# EAGLE board Tempura_V2 (EAGLE 9.6.1), part 1 of 2
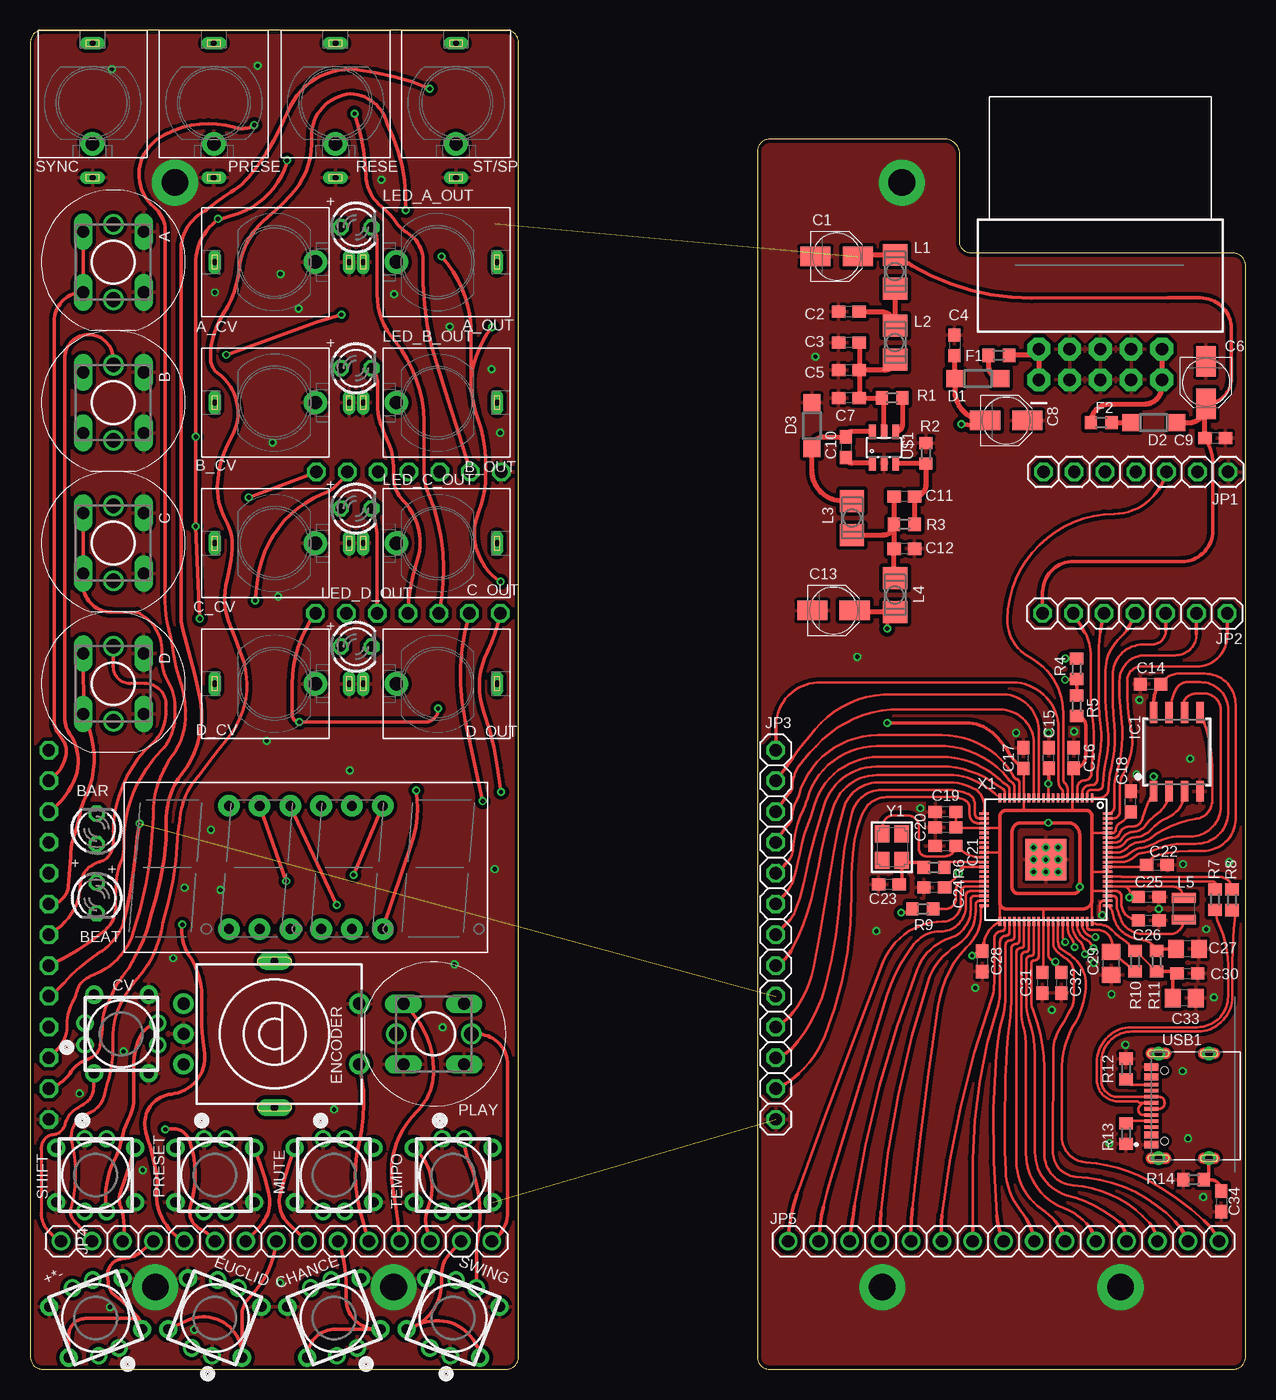
[diagram p3: board, top side]
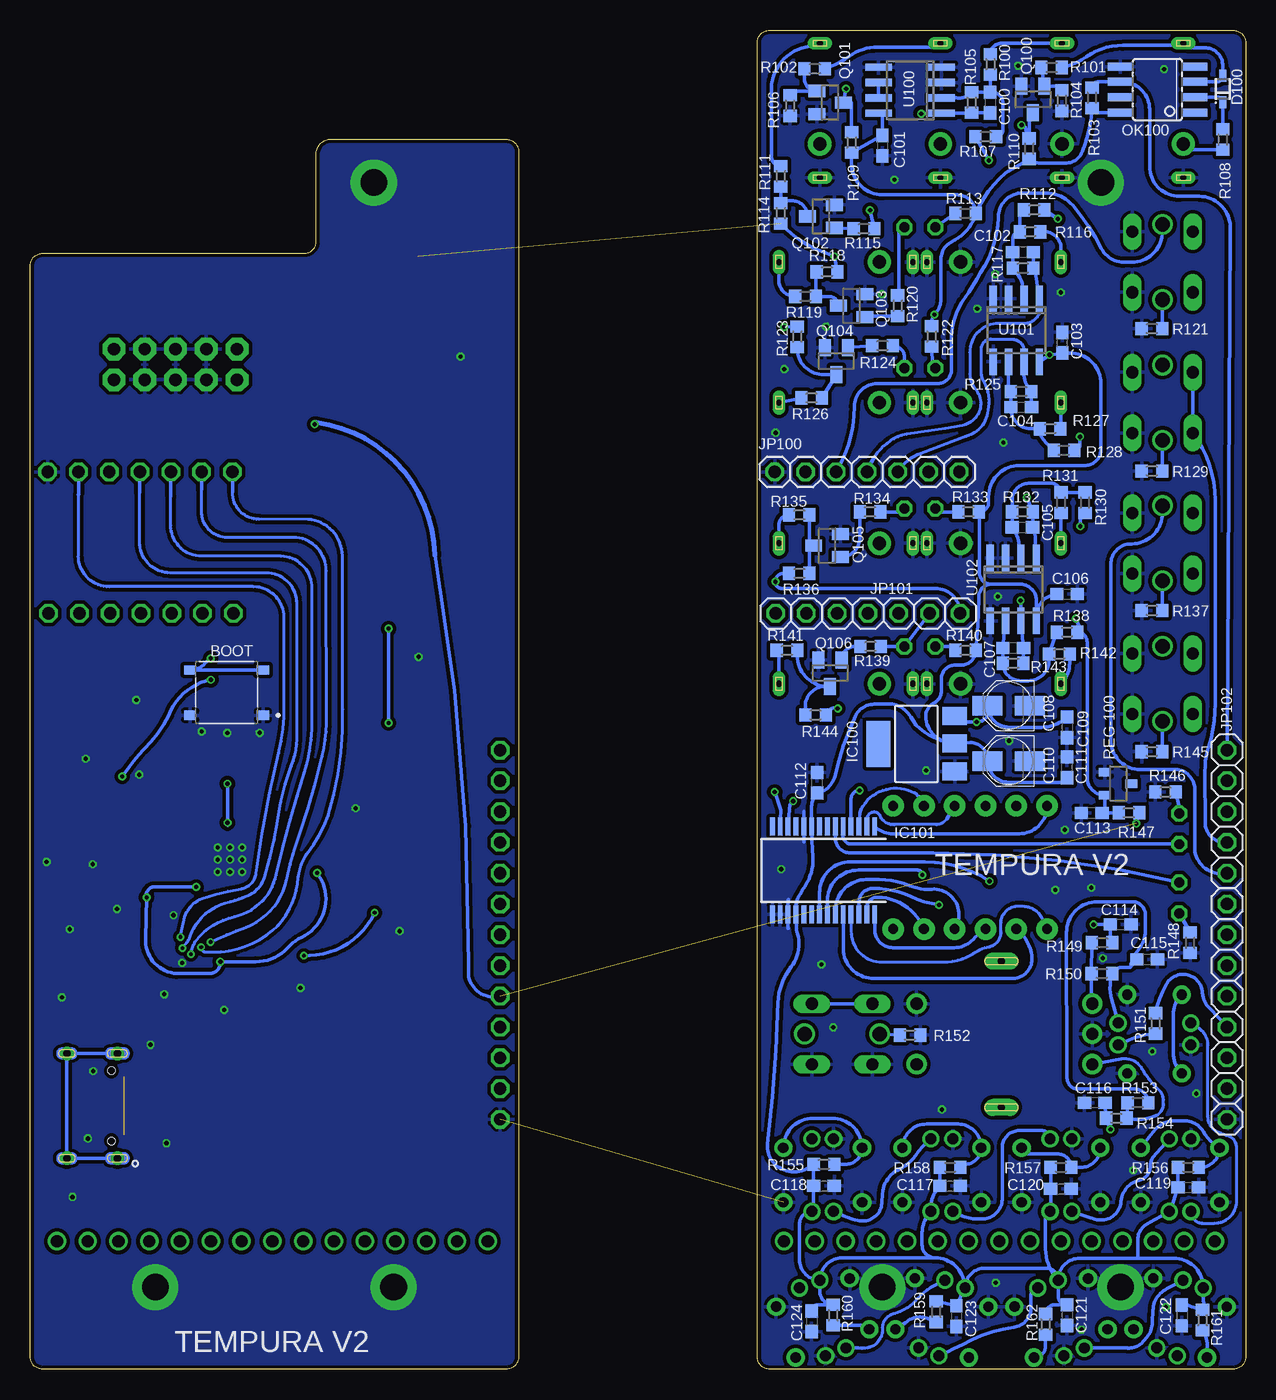
[diagram p4: board, bottom side, seen from below]

Size 100.3 x 110.5 mm. Coordinates in mm from the lower left corner, seen from the top.
Outline: 1,0 39.3,0 arc90 40.3,1 40.3,109.5 arc90 39.3,110.5 1,110.5 arc90 0,109.5 0,1 arc90 1,0
Outline: 61,0 99.3,0 arc90 100.3,1 100.3,36.21 100.3,91.09 arc90 99.3,92.09 77.7,92.09 arc-90 76.7,93.09 76.7,99.99 arc90 75.7,101.5 61,101.5 arc90 60,100.5 60,1 arc90 61,0
Copper layers (1*16): Top 0.035mm / dielectric 1.5mm / Bottom 0.035mm
Design rules "Covered_Vias": minimum track width 6mil, minimum drill 12mil, track to track 6mil, track to pad 6mil, pad to pad 6mil, via to via 6mil, smd to smd 0mil, copper to edge 10mil, drill to drill 10mil, minimum pad ring 10mil, minimum via ring 6mil, stop-mask expansion 2mil, vias tented up to drill 100mil, thermal gap 10mil

## Footprints (pad centres in the part's own frame; a part is rotated, then mirrored left to right if it is on the bottom)
BUTTON_PIXEL_ç = drill 0.85 pad 1.5: 1 -2.25,-3.25; 2 2.25,-3.25; 3 -2.25,3.25; 4 2.25,3.25 | drill 0.9 pad 1.422: DIN 3,-0.9; DOUT -3,0.9; GND -3,-0.9; VDD 3,0.9
TIMEBUTTON_HOLES_LEDS = drill 1 long: 1 -2.5,2.5; 2 2.5,2.5; 3 -2.5,-2.5; 4 2.5,-2.5 | drill 1.2: P$1 -3.1,0; P$2 3.1,0
NOHOLER_GND_SHORT_PADMINI_GND = drill 0.5 pad 1.016 long: P1 0,-6.15; P3 0,4.92 | drill 1.1 pad 1.93: P2 0,-3.38
LED3MM = drill 0.813 octagon: A -1.27,0; K 1.27,0
SW_TS-1187A-B-A-B = smd 1 x 0.75: A -3,1.875; B 3,1.875; C -3,-1.875; D 3,-1.875
PANASONIC_B = smd 2.5 x 1.6: + 1.75,0; - -1.75,0
C0603 = smd 1.1 x 1: 1 -0.85,0; 2 0.85,0
0603 = smd 1.1 x 1: 1 -0.85,0; 2 0.85,0
C0805 = smd 1.3 x 1.5: 1 -0.95,0; 2 0.95,0
SOD123 = smd 1.4 x 1.4: A 1.9,0; C -1.9,0
SOD323F = smd 1 x 0.6: A 1.1,0; C -1.1,0
CI-11 = drill 1 pad 1.676: A -2.5,-7.5; B 0,-7.5; C 2.5,-7.5; D -2.5,7; E 2.5,7 | drill 0.6 pad 1.422 long: C1 -6,0; C2 6.065,0
R0603 = smd 1 x 1.1: 1 -0.85,0; 2 0.85,0
SOIC-8 = smd 0.61 x 1.702: 1 -1.905,-3.251; 2 -0.635,-3.251; 3 0.635,-3.251; 4 1.905,-3.251; 5 1.905,3.251; 6 0.635,3.251; 7 -0.635,3.251; 8 -1.905,3.251
SOT223 = smd 1.499 x 2.007: 1 -2.261,-3.15; 2 0.025,-3.15; 3 2.311,-3.15 | smd 3.81 x 2.007: 4 0,3.15
SSOP28 = smd 0.4 x 1.5: 1 -4.225,-3.625; 2 -3.575,-3.625; 3 -2.925,-3.625; 4 -2.275,-3.625; 5 -1.625,-3.625; 6 -0.975,-3.625; 7 -0.325,-3.625; 8 0.325,-3.625; 9 0.975,-3.625; 10 1.625,-3.625; 11 2.275,-3.625; 12 2.925,-3.625; 13 3.575,-3.625; 14 4.225,-3.625; 15 4.225,3.625; 16 3.575,3.625; 17 2.925,3.625; 18 2.275,3.625; 19 1.625,3.625; 20 0.975,3.625; 21 0.325,3.625; 22 -0.325,3.625; 23 -0.975,3.625; 24 -1.625,3.625; 25 -2.275,3.625; 26 -2.925,3.625; 27 -3.575,3.625; 28 -4.225,3.625
1X07ç = drill 1.016 octagon: 1 -7.62,0; 2 -5.08,0; 3 -2.54,0; 4 0,0; 5 2.54,0; 6 5.08,0; 7 7.62,0
1X13ç = drill 1.016 octagon: 1 -13.97,0; 2 -11.43,0; 3 -8.89,0; 4 -6.35,0; 5 -3.81,0; 6 -1.27,0; 7 1.27,0; 8 3.81,0; 9 6.35,0; 10 8.89,0; 11 11.43,0; 12 13.97,0; 13 16.51,0
1X15ç = drill 1.016: 1 -17.78,0; 2 -15.24,0; 3 -12.7,0; 4 -10.16,0; 5 -7.62,0; 6 -5.08,0; 7 -2.54,0; 8 0,0; 9 2.54,0; 10 5.08,0; 11 7.62,0; 12 10.16,0; 13 12.7,0; 14 15.24,0; 15 17.78,0
L3225P = smd 1.8 x 2: 1 -1.4,0; 2 1.4,0
1008(2520) = smd 0.8 x 2: 1 -0.9,0; 2 0.9,0
7-SEGMENT-4DIGIT-30MM = drill 0.8 pad 1.778: 1 -6.35,-5.08; 2 -3.81,-5.08; 3 -1.27,-5.08; 4 1.27,-5.08; 5 3.81,-5.08; 6 6.35,-5.08; 7 6.35,5.08; 8 3.81,5.08; 9 1.27,5.08; 10 -1.27,5.08; 11 -3.81,5.08; 12 -6.35,5.08
SOIC08 = smd 0.66 x 2.032: 1 -1.905,-3.073; 2 -0.635,-3.073; 3 0.635,-3.073; 4 1.905,-3.073; 5 1.905,3.073; 6 0.635,3.073; 7 -0.635,3.073; 8 -1.905,3.073
2X5-POWER_ACODADO = drill 1.016 pad 1.88 octagon: 1 -1.27,5.08; 2 1.27,5.08; 3 -1.27,2.54; 4 1.27,2.54; 5 -1.27,0; 6 1.27,0; 7 -1.27,-2.54; 8 1.27,-2.54; 9 -1.27,-5.08; 10 1.27,-5.08
SOT23 = smd 1 x 1.4: 1 -0.95,-1.1; 2 0.95,-1.1; 3 0,1.1
DBZ_R-PDSO-G3 = smd 0.7 x 1: 1 -0.95,-1.1; 2 0.95,-1.1; 3 0,1.1
SO08 = smd 0.6 x 2.2: 1 -1.905,-2.6; 2 -0.635,-2.6; 3 0.635,-2.6; 4 1.905,-2.6; 5 1.905,2.6; 6 0.635,2.6; 7 -0.635,2.6; 8 -1.905,2.6
SOT23-6 = smd 0.55 x 1.2: 1 -0.95,-1.3; 2 0,-1.3; 3 0.95,-1.3; 4 0.95,1.3; 5 0,1.3; 6 -0.95,1.3
HRO_TYPE-C-31-M-12 = smd 0.6 x 1.14: A1_B12 -3.2,4.75; A4_B9 -2.4,4.75; B1_A12 3.2,4.75; B4_A9 2.4,4.75 | smd 0.3 x 1.14: A5 -1.25,4.75; A6 -0.25,4.75; A7 0.25,4.75; A8 1.25,4.75; B5 1.75,4.75; B6 0.75,4.75; B7 -0.75,4.75; B8 -1.75,4.75 | drill 0.6 pad 0.9: S1 -4.325,4.17; S2 4.325,4.17; S3 -4.325,0; S4 4.325,0 | hole 0.6: -2.89,3.68; 2.89,3.68
QFN80 = smd 0.78 x 0.22: 1 -5.09,3.8; 2 -5.09,3.4; 3 -5.09,3; 4 -5.09,2.6; 5 -5.09,2.2; 6 -5.09,1.8; 7 -5.09,1.4; 8 -5.09,1; 9 -5.09,0.6; 10 -5.09,0.2; 11 -5.09,-0.2; 12 -5.09,-0.6; 13 -5.09,-1; 14 -5.09,-1.4; 15 -5.09,-1.8; 16 -5.09,-2.2; 17 -5.09,-2.6; 18 -5.09,-3; 19 -5.09,-3.4; 20 -5.09,-3.8; 41 5.1,-3.8; 42 5.1,-3.4; 43 5.1,-3; 44 5.1,-2.6; 45 5.1,-2.2; 46 5.1,-1.8; 47 5.1,-1.4; 48 5.1,-1; 49 5.1,-0.6; 50 5.1,-0.2; 51 5.1,0.2; 52 5.1,0.6; 53 5.1,1; 54 5.1,1.4; 55 5.1,1.8; 56 5.1,2.2; 57 5.1,2.6; 58 5.1,3; 59 5.1,3.4; 60 5.1,3.8 | smd 0.22 x 0.78: 21 -3.8,-5.1; 22 -3.4,-5.1; 23 -3,-5.1; 24 -2.6,-5.1; 25 -2.2,-5.1; 26 -1.8,-5.1; 27 -1.4,-5.1; 28 -1,-5.1; 29 -0.6,-5.1; 30 -0.2,-5.1; 31 0.2,-5.1; 32 0.6,-5.1; 33 1,-5.1; 34 1.4,-5.1; 35 1.8,-5.1; 36 2.2,-5.1; 37 2.6,-5.1; 38 3,-5.1; 39 3.4,-5.1; 40 3.8,-5.1; 61 3.8,5.1; 62 3.4,5.1; 63 3,5.1; 64 2.6,5.1; 65 2.2,5.1; 66 1.8,5.1; 67 1.4,5.1; 68 1,5.1; 69 0.6,5.1; 70 0.2,5.1; 71 -0.2,5.1; 72 -0.6,5.1; 73 -1,5.1; 74 -1.4,5.1; 75 -1.8,5.1; 76 -2.2,5.1; 77 -2.6,5.1; 78 -3,5.1; 79 -3.4,5.1; 80 -3.8,5.1 | smd 3.4 x 3.4: MNT 0,0
CRYSTAL_3.2X2.5 = smd 1.4 x 1.2: 1 -1.1,-0.8; 2 1.1,0.8; GND1 -1.1,0.8; GND2 1.1,-0.8

## Placement (x,y rotation side)
+*-  BUTTON_NEOPIXELBUTTON_PIXEL_ç  [BUTTON_PIXEL_ç]  5.4,4.23 111.1 top
A  DTS-6_LED  [TIMEBUTTON_HOLES_LEDS]  6.85,91.37 270 top
A_CV  OG-PJ301_PJ301_THONKICONNNOHOLER  [NOHOLER_GND_SHORT_PADMINI_GND]  20.15,91.37 90 top
A_OUT  OG-PJ301_PJ301_THONKICONNNOHOLER  [NOHOLER_GND_SHORT_PADMINI_GND]  33.6,91.37 270 top
B  DTS-6_LED  [TIMEBUTTON_HOLES_LEDS]  6.85,79.77 270 top
B_CV  OG-PJ301_PJ301_THONKICONNNOHOLER  [NOHOLER_GND_SHORT_PADMINI_GND]  20.15,79.77 90 top
B_OUT  OG-PJ301_PJ301_THONKICONNNOHOLER  [NOHOLER_GND_SHORT_PADMINI_GND]  33.6,79.77 270 top
BAR  OSG5TA7NE4B  [LED3MM]  5.48,44.6 90 top
BEAT  OSO5JA7NE4B  [LED3MM]  5.48,38.89 270 top
BOOT  TS-1187A-B-A-B  [SW_TS-1187A-B-A-B]  84.1,55.85 180 bottom
C  DTS-6_LED  [TIMEBUTTON_HOLES_LEDS]  6.85,68.17 270 top
C1  10uF  [PANASONIC_B]  66.55,91.84 0 top
C2  10n  [C0603]  67.56,87.27 180 top
C3  100n  [C0603]  67.56,84.73 180 top
C4  100n  [C0603]  76.28,84.5 270 top
C5  10uF  [C0603]  67.56,82.44 180 top
C6  10uF  [PANASONIC_B]  97.03,81.42 270 top
C7  100n  [C0603]  67.56,80.15 180 top
C8  10uF  [PANASONIC_B]  80.54,78.3 0 top
C9  100n  [C0603]  97.79,76.85 0 top
C10  100n  [C0603]  67.31,76.09 270 top
C11  100n  [C0603]  72.14,72.03 180 top
C12  22uF  [C0603]  72.14,67.71 180 top
C13  10uF  [PANASONIC_B]  66.29,62.63 0 top
C14  100n  [0603]  92.46,56.53 180 top
C15  100n  [0603]  84.05,50.44 90 top
C16  100n  [0603]  86.11,50.44 90 top
C17  100n  [0603]  81.97,50.43 90 top
C18  100n  [0603]  90.81,46.84 90 top
C19  100n  [0603]  75.54,45.99 180 top
C20  100n  [0603]  75.54,44.72 180 top
C21  15pF  [0603]  75.54,43.2 180 top
C22  100n  [C0603]  92.97,41.62 0 top
C23  15pF  [0603]  70.87,40.02 180 top
C24  4.7uF  [0603]  74.6,39.77 180 top
C25  4.7uF  [0603]  92.3,38.98 0 top
C26  4.7uF  [C0603]  92.3,37.02 180 top
C27  4.7uF  [C0805]  95.5,34.69 180 top
C28  100n  [0603]  78.56,33.66 270 top
C29  4.7uF  [C0805]  89.2,33.49 90 top
C30  100n  [0603]  95.5,32.66 0 top
C31  100n  [0603]  83.52,31.89 270 top
C32  100n  [0603]  85.09,31.89 270 top
C33  4.7uF  [C0805]  95.25,30.62 180 top
C34  10n  [C0603]  98.3,13.86 270 top
C100  100pF  [C0603]  21.08,104.54 270 bottom
C101  100n  [C0603]  29.97,100.98 270 bottom
C102  100pF  [C0603]  18.36,92.19 0 bottom
C103  100n  [C0603]  15.11,84.73 90 bottom
C104  100pF  [C0603]  18.52,79.39 0 bottom
C105  100pF  [C0603]  18.41,69.49 0 bottom
C106  100n  [C0603]  14.73,63.97 0 bottom
C107  100pF  [C0603]  19.18,59.53 0 bottom
C108  10uF  [PANASONIC_B]  19.56,54.75 180 bottom
C109  100n  [C0603]  14.73,52.98 270 bottom
C110  10uF  [PANASONIC_B]  19.56,50.18 180 bottom
C111  100n  [C0603]  14.73,49.67 90 bottom
C112  100n  [C0603]  35.36,48.4 90 bottom
C113  100nF  [C0603]  12.7,45.91 0 bottom
C114  100nF  [C0603]  10.31,36.69 180 bottom
C115  100n  [C0603]  8.13,33.82 0 bottom
C116  100nF  [C0603]  12.45,21.99 180 bottom
C117  100n  [C0603]  24.38,15.13 0 bottom
C118  100n  [C0603]  34.8,15.13 0 bottom
C119  100n  [C0603]  4.72,15 0 bottom
C120  100n  [C0603]  15.24,14.88 0 bottom
C121  100n  [C0603]  14.73,4.46 270 bottom
C122  100n  [C0603]  5.26,4.44 270 bottom
C123  100n  [C0603]  23.88,4.39 270 bottom
C124  100n  [C0603]  35.81,3.95 270 bottom
C_CV  OG-PJ301_PJ301_THONKICONNNOHOLER  [NOHOLER_GND_SHORT_PADMINI_GND]  20.15,68.17 90 top
C_OUT  OG-PJ301_PJ301_THONKICONNNOHOLER  [NOHOLER_GND_SHORT_PADMINI_GND]  33.6,68.17 270 top
CHANCE  BUTTON_NEOPIXELBUTTON_PIXEL_ç  [BUTTON_PIXEL_ç]  25.07,4.23 111.1 top
CV  BUTTON_NEOPIXELBUTTON_PIXEL_ç  [BUTTON_PIXEL_ç]  7.52,27.67 0 top
D  DTS-6_LED  [TIMEBUTTON_HOLES_LEDS]  6.85,56.57 270 top
D1  SS1040_R1_00001  [SOD123]  78.21,81.75 180 top
D2  SS1040_R1_00001  [SOD123]  92.71,78.12 180 top
D3  SS1040_R1_00001  [SOD123]  64.52,77.87 90 top
D100  1N4148WS  [SOD323F]  1.88,105.66 90 bottom
D_CV  OG-PJ301_PJ301_THONKICONNNOHOLER  [NOHOLER_GND_SHORT_PADMINI_GND]  20.15,56.57 90 top
D_OUT  OG-PJ301_PJ301_THONKICONNNOHOLER  [NOHOLER_GND_SHORT_PADMINI_GND]  33.6,56.57 270 top
ENCODER  CI-11  [CI-11]  20.15,27.67 270 top
EUCLID  BUTTON_NEOPIXELBUTTON_PIXEL_ç  [BUTTON_PIXEL_ç]  15.23,4.23 69 top
F1  F2  [R0603]  79.93,83.68 0 top
F2  F1  [R0603]  88.39,78.12 180 top
IC1  W25Q128JVSIQ  [SOIC-8]  94.62,50.94 0 top
IC100  LM1117-3.3  [SOT223]  27.15,51.6 90 bottom
IC101  MCP23017SS  [SSOP28]  34.84,41.16 180 bottom
JP1  [1X07ç]  91.24,74.06 180 top
JP2  [1X07ç]  91.17,62.37 180 top
JP3  [1X13ç]  61.52,37.13 270 top
JP4  [1X15ç]  20.32,10.56 0 top
JP5  [1X15ç]  80.32,10.56 0 top
JP100  [1X07ç]  31.24,74.06 0 bottom
JP101  [1X07ç]  31.17,62.37 0 bottom
JP102  [1X13ç]  1.52,37.13 270 bottom
L1  0.1uH  [L3225P]  71.37,90.57 270 top
L2  0.1uH  [L3225P]  71.37,84.73 270 top
L3  4.7uH  [L3225P]  67.82,70.25 270 top
L4  0.1uH  [L3225P]  71.37,63.9 270 top
L5  3.3μH  [1008(2520)]  95.2,37.99 270 top
LED_A_OUT  2 MM LED  [LED3MM]  26.88,94.24 0 top
LED_B_OUT  2 MM LED  [LED3MM]  26.88,82.62 0 top
LED_C_OUT  2 MM LED  [LED3MM]  26.88,71.04 0 top
LED_D_OUT  2 MM LED  [LED3MM]  26.88,59.64 0 top
LFD36BUE-101B  7-SEGMENT-4DIGIT-20MM  [7-SEGMENT-4DIGIT-30MM]  22.73,41.41 0 top
MUTE  BUTTON_NEOPIXELBUTTON_PIXEL_ç  [BUTTON_PIXEL_ç]  25.07,16.02 270 top
OK100  HCPL0700  [SOIC08]  7.26,105.6 90 bottom
PLAY  DTS-6_LED  [TIMEBUTTON_HOLES_LEDS]  33.3,27.67 180 top
POWER  M05X2RAF  [2X5-POWER_ACODADO]  88.32,82.92 90 top
PRESE  OG-PJ301_PJ301_THONKICONNNOHOLER  [NOHOLER_GND_SHORT_PADMINI_GND]  15.15,104.5 0 top
PRESET  BUTTON_NEOPIXELBUTTON_PIXEL_ç  [BUTTON_PIXEL_ç]  15.23,16.02 270 top
Q100  BC846  [SOT23]  17.55,104.79 180 bottom
Q101  BC846  [SOT23]  34.29,104.54 270 bottom
Q102  BC846  [SOT23]  35.05,95.14 90 bottom
Q103  BC846  [SOT23]  32.51,87.77 90 bottom
Q104  BC846  [SOT23]  33.78,83.2 180 bottom
Q105  BC846  [SOT23]  34.54,67.96 90 bottom
Q106  BC846  [SOT23]  34.29,57.45 180 bottom
R1  100k  [R0603]  71.12,80.15 0 top
R2  16k2  [R0603]  73.91,75.58 270 top
R3  49k9  [R0603]  72.14,69.74 0 top
R4  1k  [R0603]  86.36,57.8 90 top
R5  10k  [R0603]  86.36,54.75 270 top
R6  1K  [R0603]  74.58,41.41 180 top
R7  27 Ohm  [R0603]  97.79,38.75 90 top
R8  27 Ohm  [R0603]  99.19,38.74 90 top
R9  10K  [R0603]  73.66,37.99 180 top
R10  200 Ohm  [R0603]  91.19,33.67 90 top
R11  33 Ohm  [R0603]  92.96,33.67 270 top
R12  5.1K  [R0603]  90.42,24.78 270 top
R13  5.1K  [R0603]  90.42,19.45 270 top
R14  1M  [R0603]  96.01,15.64 0 top
R100  100k  [R0603]  21.06,107.69 90 bottom
R101  100k  [R0603]  16,107.43 0 bottom
R102  100k  [R0603]  35.56,107.33 0 bottom
R103  270 Ohm  [R0603]  12.67,104.92 270 bottom
R104  1M  [R0603]  15.16,104.69 90 bottom
R105  22k  [R0603]  22.61,104.54 90 bottom
R106  1M  [R0603]  37.59,104.28 90 bottom
R107  100k  [R0603]  21.44,101.72 180 bottom
R108  220 Ohm  [R0603]  1.88,101.49 270 bottom
R109  10k  [R0603]  32.51,101.24 270 bottom
R110  10k  [R0603]  17.86,100.73 270 bottom
R111  100 Ohm  [R0603]  38.35,98.44 90 bottom
R112  100k  [R0603]  17.45,95.67 0 bottom
R113  470 Ohm  [R0603]  23.11,95.39 180 bottom
R114  1k  [R0603]  38.35,95.39 90 bottom
R115  1k  [R0603]  31.5,94.12 0 bottom
R116  100k  [R0603]  17.78,93.87 0 bottom
R117  22k  [R0603]  18.36,90.87 180 bottom
R118  1k  [R0603]  34.54,90.57 180 bottom
R119  100 Ohm  [R0603]  36.32,88.54 180 bottom
R120  1k  [R0603]  28.7,87.77 90 bottom
R121  100 Ohm  [R0603]  7.73,85.88 180 bottom
R122  470 Ohm  [R0603]  25.91,85.23 270 bottom
R123  1k  [R0603]  36.99,85.2 270 bottom
R124  1k  [R0603]  29.97,84.47 0 bottom
R125  22k  [R0603]  18.52,80.69 180 bottom
R126  100 Ohm  [R0603]  35.81,80.15 180 bottom
R127  100k  [R0603]  16.13,77.61 0 bottom
R128  100k  [R0603]  14.99,75.84 0 bottom
R129  100 Ohm  [R0603]  7.73,74.12 180 bottom
R130  100k  [R0603]  13.26,71.52 270 bottom
R131  100k  [R0603]  15.24,71.52 270 bottom
R132  22k  [R0603]  18.41,70.76 180 bottom
R133  470 Ohm  [R0603]  22.86,70.76 180 bottom
R134  1k  [R0603]  30.99,70.76 0 bottom
R135  100 Ohm  [R0603]  36.83,70.5 180 bottom
R136  1k  [R0603]  36.83,65.68 0 bottom
R137  100 Ohm  [R0603]  7.73,62.61 180 bottom
R138  100k  [R0603]  14.73,60.82 0 bottom
R139  1k  [R0603]  30.94,59.65 0 bottom
R140  470 Ohm  [R0603]  23.11,59.33 180 bottom
R141  100 Ohm  [R0603]  37.85,59.33 180 bottom
R142  100k  [R0603]  15.37,59.02 0 bottom
R143  22k  [R0603]  19.18,58.26 180 bottom
R144  1k  [R0603]  35.48,53.99 180 bottom
R145  100 Ohm  [R0603]  7.73,50.97 180 bottom
R146  1k  [R0603]  6.6,47.64 0 bottom
R147  1k  [R0603]  9.63,45.91 0 bottom
R148  1k  [R0603]  4.57,35.2 90 bottom
R149  10k  [R0603]  11.84,35.2 0 bottom
R150  10k  [R0603]  11.86,32.66 180 bottom
R151  560 Ohm  [R0603]  7.44,28.54 270 bottom
R152  100 Ohm  [R0603]  27.69,27.58 0 bottom
R153  10k  [R0603]  8.89,21.99 180 bottom
R154  10k  [R0603]  10.67,20.72 0 bottom
R155  2k2  [R0603]  34.8,16.91 180 bottom
R156  2k2  [R0603]  4.72,16.65 180 bottom
R157  2k2  [R0603]  15.24,16.65 180 bottom
R158  2k2  [R0603]  24.38,16.65 180 bottom
R159  2k2  [R0603]  25.53,4.74 90 bottom
R160  2k2  [R0603]  34.04,4.46 90 bottom
R161  2k2  [R0603]  3.56,4.06 90 bottom
R162  2k2  [R0603]  16.51,3.7 90 bottom
REG-100  LM4040C10ILP  [DBZ_R-PDSO-G3]  10.52,48.33 270 bottom
RESE  OG-PJ301_PJ301_THONKICONNNOHOLER  [NOHOLER_GND_SHORT_PADMINI_GND]  25.18,104.5 0 top
SHIFT  BUTTON_NEOPIXELBUTTON_PIXEL_ç  [BUTTON_PIXEL_ç]  5.4,16.02 270 top
ST/SP  OG-PJ301_PJ301_THONKICONNNOHOLER  [NOHOLER_GND_SHORT_PADMINI_GND]  35.13,104.5 0 top
SWING  BUTTON_NEOPIXELBUTTON_PIXEL_ç  [BUTTON_PIXEL_ç]  34.9,4.23 69 top
SYNC  OG-PJ301_PJ301_THONKICONNNOHOLER  [NOHOLER_GND_SHORT_PADMINI_GND]  5.14,104.5 0 top
TEMPO  BUTTON_NEOPIXELBUTTON_PIXEL_ç  [BUTTON_PIXEL_ç]  34.9,16.02 270 top
U100  MCP6002_  [SO08]  27.69,105.55 90 bottom
U101  MCP6002_  [SO08]  18.92,85.74 180 bottom
U102  MCP6002_  [SO08]  19.18,64.36 180 bottom
U$1  BL9342  [SOT23-6]  70.46,76.07 0 top
USB1  TYPE-C-31-M-12  [HRO_TYPE-C-31-M-12]  97.28,21.73 90 top
X1  RP2350B  [QFN80]  83.82,42.05 270 top
Y1  12MHZ  [CRYSTAL_3.2X2.5]  71.12,43.07 270 top